# Altium project LED.PrjPcb
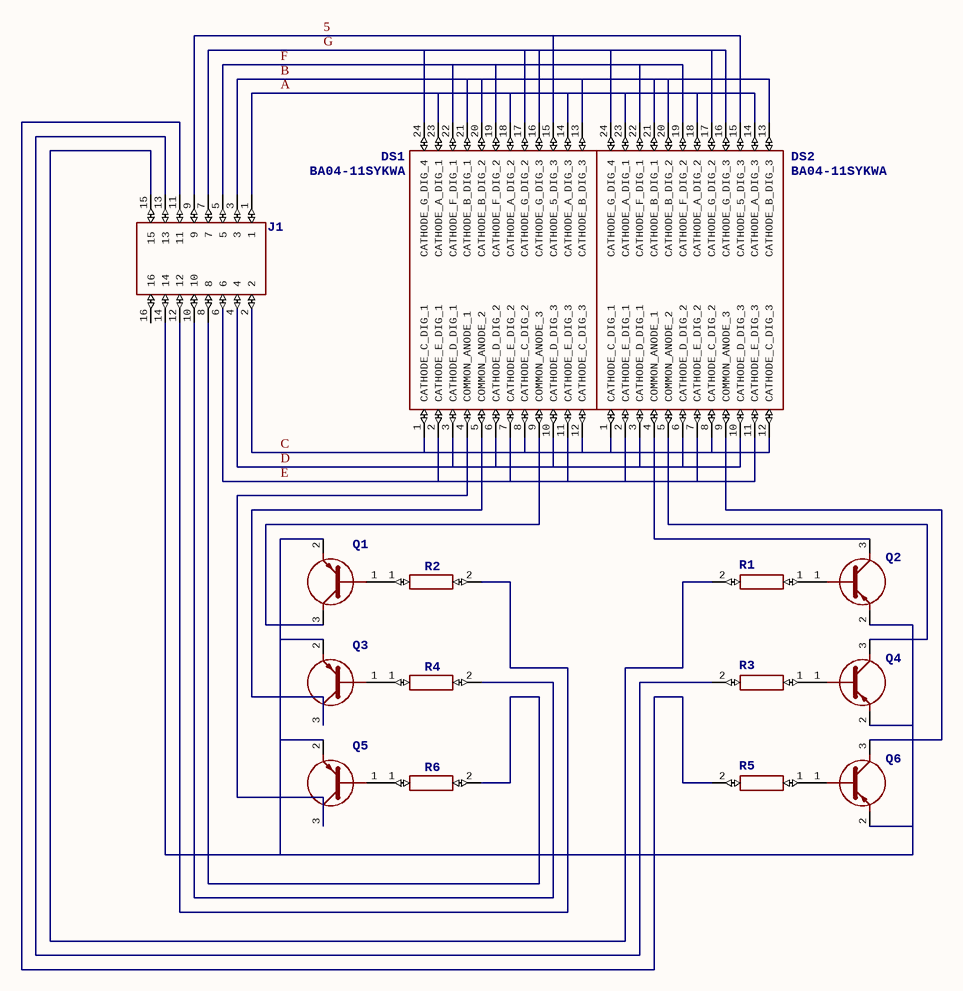
[diagram p0: LED_SHEET.SchDoc]
1 sheet, 15 parts. Net scope: global (net labels, ports and power ports of the same name join across sheets).

## Sheet LED_SHEET.SchDoc: LED Screen Sheet
size A4; DrawnBy: Fabian INGREMEAU; Revision: 1.0.0; SheetNumber: 1; SheetTotal: 3; ProjectName: TheTomcatProject

### Parts
DS1  BA04-11SYKWA  [DIPS1270W70P254L3020H725Q24N]
DS2  BA04-11SYKWA  [DIPS1270W70P254L3020H725Q24N]
J1  (no value)  [SHDR16W64P254_2X8_2790X860X930]
Q1  (no value)  [SOT95P230X110-3N]
Q2  (no value)  [SOT95P230X110-3N]
Q3  (no value)  [SOT95P230X110-3N]
Q4  (no value)  [SOT95P230X110-3N]
Q5  (no value)  [SOT95P230X110-3N]
Q6  (no value)  [SOT95P230X110-3N]
R1  (no value)  [RESC3116X65N]
R2  (no value)  [RESC3116X65N]
R3  (no value)  [RESC3116X65N]
R4  (no value)  [RESC3116X65N]
R5  (no value)  [RESC3116X65N]
R6  (no value)  [RESC3116X65N]

### Nets
5: DS1.15(CATHODE_5_DIG_3) DS2.15(CATHODE_5_DIG_3) J1.9
A: DS1.14(CATHODE_A_DIG_3) DS1.18(CATHODE_A_DIG_2) DS1.23(CATHODE_A_DIG_1) DS2.14(CATHODE_A_DIG_3) DS2.18(CATHODE_A_DIG_2) DS2.23(CATHODE_A_DIG_1) J1.1
B: DS1.13(CATHODE_B_DIG_3) DS1.20(CATHODE_B_DIG_2) DS1.21(CATHODE_B_DIG_1) DS2.13(CATHODE_B_DIG_3) DS2.20(CATHODE_B_DIG_2) DS2.21(CATHODE_B_DIG_1) J1.3
C: DS1.1(CATHODE_C_DIG_1) DS1.8(CATHODE_C_DIG_2) DS1.12(CATHODE_C_DIG_3) DS2.1(CATHODE_C_DIG_1) DS2.8(CATHODE_C_DIG_2) DS2.12(CATHODE_C_DIG_3) J1.2
D: DS1.3(CATHODE_D_DIG_1) DS1.6(CATHODE_D_DIG_2) DS1.10(CATHODE_D_DIG_3) DS2.3(CATHODE_D_DIG_1) DS2.6(CATHODE_D_DIG_2) DS2.10(CATHODE_D_DIG_3) J1.4
E: DS1.2(CATHODE_E_DIG_1) DS1.7(CATHODE_E_DIG_2) DS1.11(CATHODE_E_DIG_3) DS2.2(CATHODE_E_DIG_1) DS2.7(CATHODE_E_DIG_2) DS2.11(CATHODE_E_DIG_3) J1.6
F: DS1.19(CATHODE_F_DIG_2) DS1.22(CATHODE_F_DIG_1) DS2.19(CATHODE_F_DIG_2) DS2.22(CATHODE_F_DIG_1) J1.5
G: DS1.16(CATHODE_G_DIG_3) DS1.17(CATHODE_G_DIG_2) DS1.24(CATHODE_G_DIG_4) DS2.16(CATHODE_G_DIG_3) DS2.17(CATHODE_G_DIG_2) DS2.24(CATHODE_G_DIG_4) J1.7
NetDS1_4: DS1.4(COMMON_ANODE_1) Q5.3(C)
NetDS1_5: DS1.5(COMMON_ANODE_2) Q3.3(C)
NetDS1_9: DS1.9(COMMON_ANODE_3) Q1.3(C)
NetDS2_4: DS2.4(COMMON_ANODE_1) Q2.3(C)
NetDS2_5: DS2.5(COMMON_ANODE_2) Q4.3(C)
NetDS2_9: DS2.9(COMMON_ANODE_3) Q6.3(C)
NetJ1_8: J1.8 R6.2
NetJ1_10: J1.10 R4.2
NetJ1_11: J1.11 R5.2
NetJ1_12: J1.12 R2.2
NetJ1_13: J1.13 R3.2
NetJ1_14: J1.14 Q1.2(E) Q2.2(E) Q3.2(E) Q4.2(E) Q5.2(E) Q6.2(E)
NetJ1_15: J1.15 R1.2
NetQ1_1: Q1.1(B) R2.1
NetQ2_1: Q2.1(B) R1.1
NetQ3_1: Q3.1(B) R4.1
NetQ4_1: Q4.1(B) R3.1
NetQ5_1: Q5.1(B) R6.1
NetQ6_1: Q6.1(B) R5.1

Not connected (* = marked no-connect by the designer): J1 16

### Notes on the sheet
- Title
- Size:
- Date:
- A4
- Number:
- Time:
- Revision:
- Sheet
- of
- File:

### Library data of the parts
DS1 DS2 = BA04-11SYKWA: Manufacturer_Name: Kingbright; Manufacturer_Part_Number: BA04-11SYKWA; Mouser_Part_Number: N/A; Mouser_Price-Stock: https://www.mouser.com/Search/Refine.aspx?Keyword=N%2FA; Height: 7.25mm
J1 = 6257268: Manufacturer_Name: RS Components; Manufacturer_Part_Number: 6257268; Height: 9.3mm
Q1-Q6 = BC857,215: Manufacturer_Name: Nexperia; Manufacturer_Part_Number: BC857,215; Mouser_Part_Number: 771-BC857215; Mouser_Price-Stock: https://www.mouser.co.uk/ProductDetail/Nexperia/BC857215?qs=me8TqzrmIYWtuVsCNoXfHg%3D%3D; Arrow_Part_Number: BC857,215; Arrow_Price-Stock: https://www.arrow.com/en/products/bc857215/nexperia?region=nac; Height: 1.1mm
R1-R6 = CRG1206F150R: Manufacturer_Name: TE Connectivity; Manufacturer_Part_Number: CRG1206F150R; Mouser_Part_Number: 279-CRG1206F150R; Mouser_Price-Stock: https://www.mouser.com/Search/Refine.aspx?Keyword=279-CRG1206F150R; Arrow_Part_Number: CRG1206F150R; Arrow_Price-Stock: https://www.arrow.com/en/products/crg1206f150r/te-connectivity; Height: 0.65mm